# EAGLE design baseband_generator (EAGLE 9.6.2)

## Sheet 1 of 2
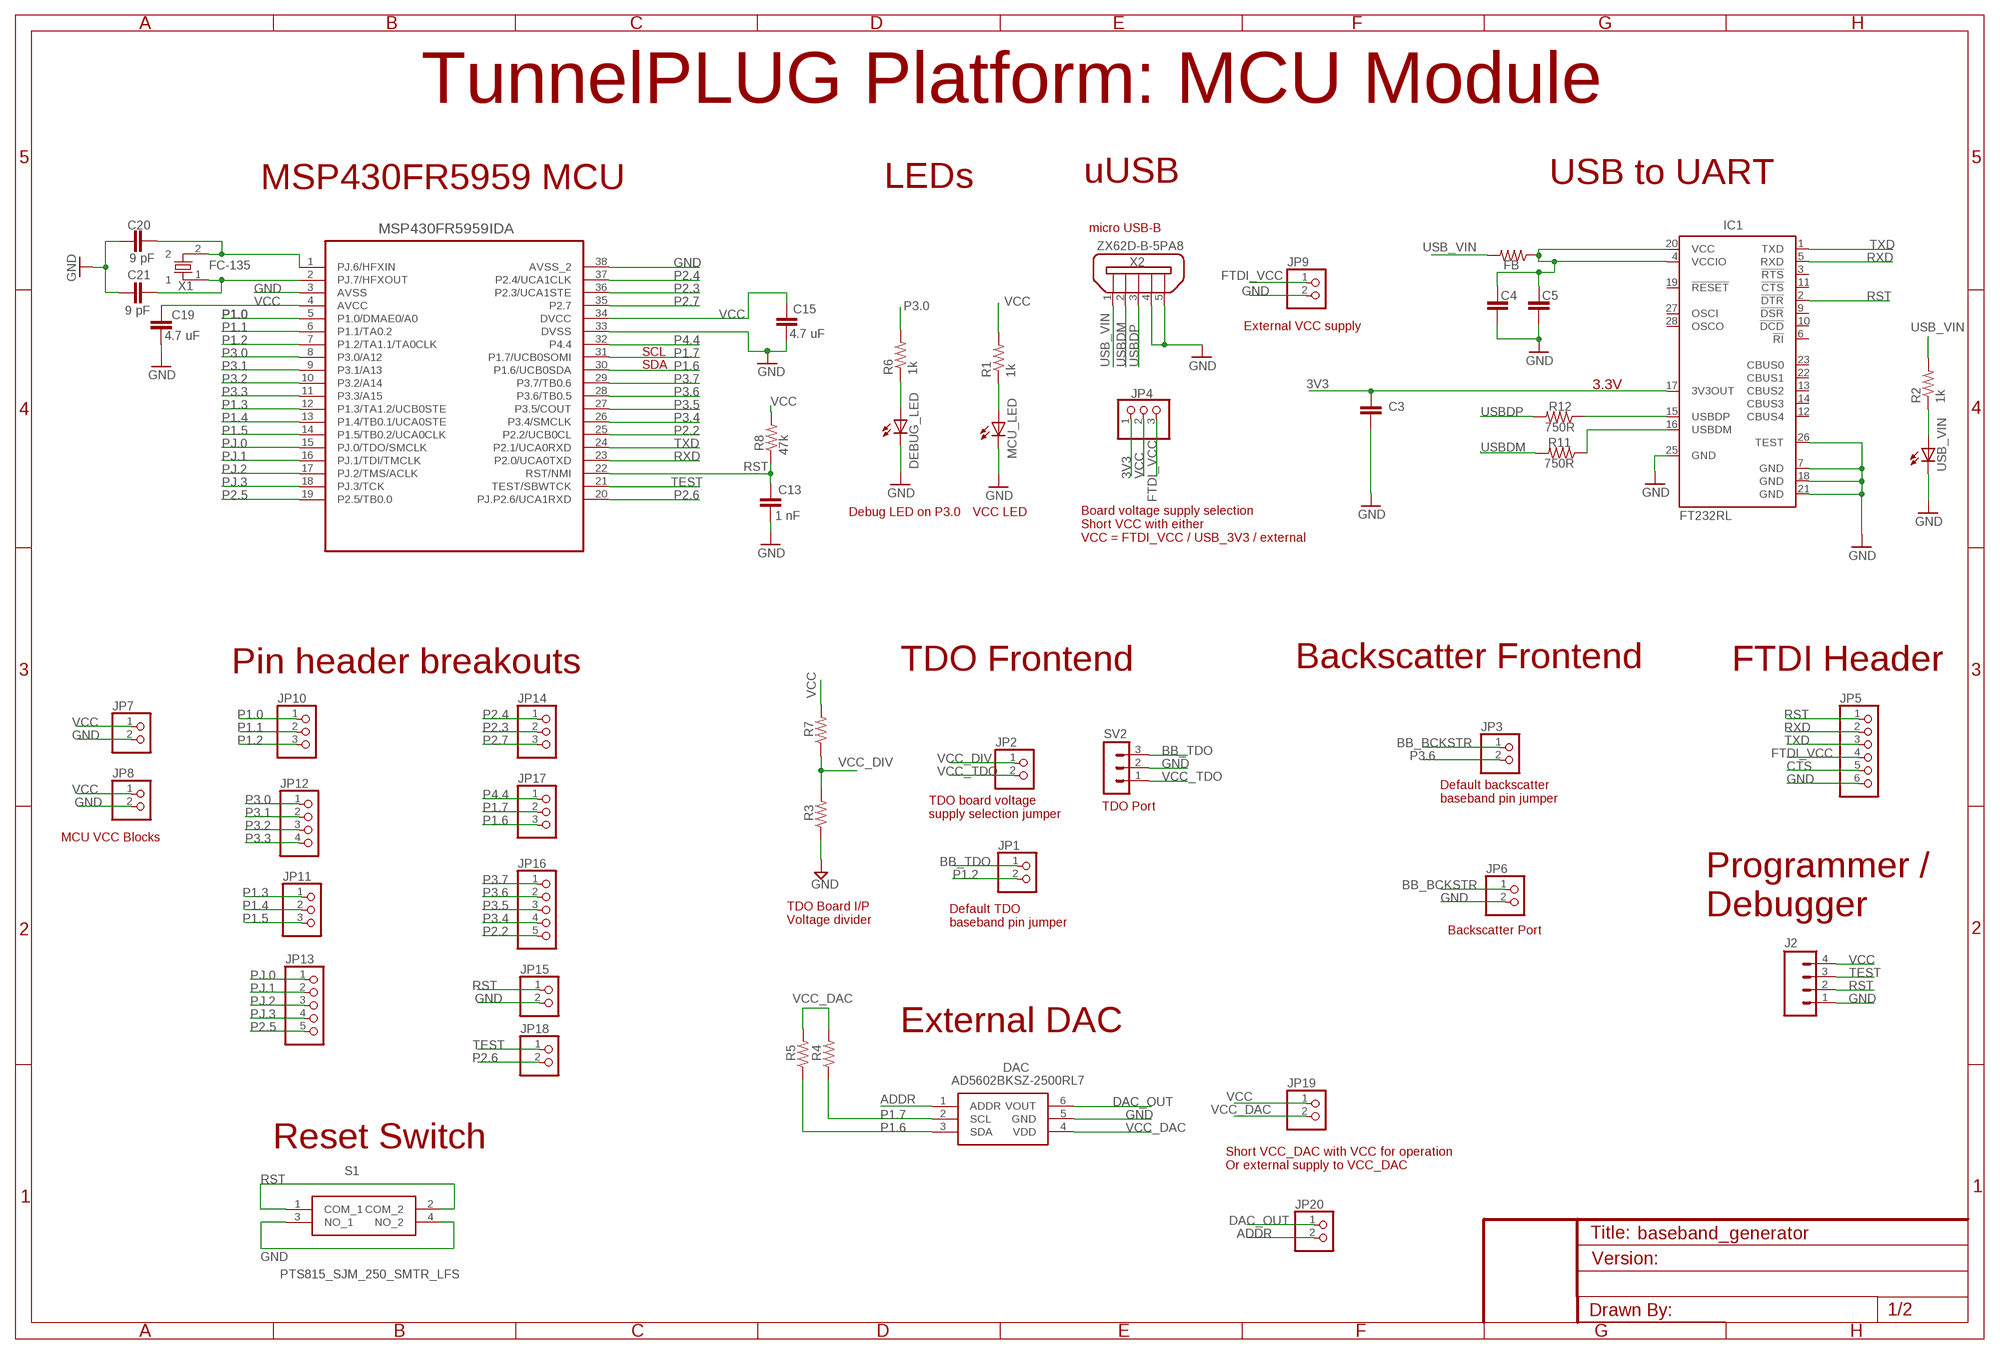
[diagram p0: schematic, sheet 1]

### Parts
C3  0805_1  [0805_1PRIMARY]
C4  0805_1  [0805_1PRIMARY]
C5  0805_1  [0805_1PRIMARY]
C13  1 nF  CAPACITOR  [C0603]
C15  4.7 uF  CAPACITOR  [C0603]
C19  4.7 uF  CAPACITOR  [C0603]
C20  9 pF  CAPACITOR  [C0603]
C21  9 pF  CAPACITOR  [C0603]
DAC  AD5602BKSZ-2500RL7  [SOT65P210X110-6N]
DEBUG_LED  LED0603  [LED-0603]
FB  RESISTOR0805-RES  [0805]
IC1  FT232RL  [SSOP28]
J2  MHDR1X4_1  [MHDR1X4_1PRIMARY]
JP1  PINHD-1X2/LOCK  [1X02/LOCK]
JP2  PINHD-1X2/LOCK  [1X02/LOCK]
JP3  PINHD-1X2/LOCK  [1X02/LOCK]
JP4  PINHD-1X3/LOCK  [1X03/LOCK]
JP5  PINHD-1X6/90  [1X06/90]
JP6  PINHD-1X2  [1X02]
JP7  PINHD-1X2  [1X02]
JP8  PINHD-1X2  [1X02]
JP9  PINHD-1X2  [1X02]
JP10  PINHD-1X3  [1X03]
JP11  PINHD-1X3  [1X03]
JP12  PINHD-1X4  [1X04]
JP13  PINHD-1X5  [1X05]
JP14  PINHD-1X3  [1X03]
JP15  PINHD-1X2  [1X02]
JP16  PINHD-1X5  [1X05]
JP17  PINHD-1X3  [1X03]
JP18  PINHD-1X2  [1X02]
JP19  PINHD-1X2  [1X02]
JP20  PINHD-1X2  [1X02]
MCU_LED  LED0603  [LED-0603]
R1  1k  RESISTOR0805-RES  [0805]
R2  1k  RESISTOR0805-RES  [0805]
R3  R-US_R0603  [R0603]
R4  R-US_R0603  [R0603]
R5  R-US_R0603  [R0603]
R6  1k  RESISTOR0805-RES  [0805]
R7  R-US_R0603  [R0603]
R8  47k  RESISTOR0805-RES  [0805]
R11  750R  RESISTOR0805-RES  [0805]
R12  750R  RESISTOR0805-RES  [0805]
S1  PTS815_SJM_250_SMTR_LFS  [PTS815SJM250SMTRLFS]
SV2  MA03-1  [MA03-1]
U2  MSP430FR5739IDAMSP430FR5959IDA  [SOP65P810X120-38N]
USB_VIN  LED0603  [LED-0603]
X1  FC-135  [FC-135_1PRIMARY]
X2  ZX62D-B-5PA8  [ZX62D-B-5PA8]

### Nets
3V3: C3.1 IC1.17(3V3OUT) JP4.1
ADDR: DAC.1(ADDR) JP20.2
BB_BCKSTR: JP3.1 JP6.1
BB_TDO: JP1.1 SV2.3
CTS: JP5.5
DAC_OUT: DAC.6(VOUT) JP20.1
FTDI_VCC: JP4.3 JP5.4 JP9.1
GND: C3.2 C4.2 C5.2 C13.2 C15.1 C19.2 C20.2 C21.2 DAC.5(GND) DEBUG_LED.C IC1.7(GND) IC1.18(GND) IC1.21(GND) IC1.25(GND) IC1.26(TEST) J2.1 JP5.6 JP6.2 JP7.2 JP8.2 JP9.2 JP15.2 MCU_LED.C R3.1 S1.3(NO_1) S1.4(NO_2) SV2.2 U2.3(AVSS) U2.33(DVSS) U2.38(AVSS_2) USB_VIN.C X2.4 X2.5
N$2: C21.1 U2.2(PJ.7/HFXOUT) X1.1
N$3: C20.1 U2.1(PJ.6/HFXIN) X1.2
N$4: DEBUG_LED.A R6.1
N$5: MCU_LED.A R1.1
N$6: R2.1 USB_VIN.A
N$9: C4.1 C5.1 FB.1 IC1.4(VCCIO) IC1.20(VCC)
N$10: IC1.15(USBDP) R12.1
N$11: IC1.16(USBDM) R11.1
P1.0: JP10.1 U2.5(P1.0/DMAE0/A0)
P1.1: JP10.2 U2.6(P1.1/TA0.2)
P1.2: JP1.2 JP10.3 U2.7(P1.2/TA1.1/TA0CLK)
P1.3: JP11.1 U2.12(P1.3/TA1.2/UCB0STE)
P1.4: JP11.2 U2.13(P1.4/TB0.1/UCA0STE)
P1.5: JP11.3 U2.14(P1.5/TB0.2/UCA0CLK)
P1.6: DAC.3(SDA) JP17.3 R5.1 U2.30(P1.6/UCB0SDA)
P1.7: DAC.2(SCL) JP17.2 R4.1 U2.31(P1.7/UCB0SOMI)
P2.2: JP16.5 U2.25(P2.2/UCB0CL)
P2.3: JP14.2 U2.36(P2.3/UCA1STE)
P2.4: JP14.1 U2.37(P2.4/UCA1CLK)
P2.5: JP13.5 U2.19(P2.5/TB0.0)
P2.6: JP18.2 U2.20(PJ.P2.6/UCA1RXD)
P2.7: JP14.3 U2.35(P2.7)
P3.0: JP12.1 R6.2 U2.8(P3.0/A12)
P3.1: JP12.2 U2.9(P3.1/A13)
P3.2: JP12.3 U2.10(P3.2/A14)
P3.3: JP12.4 U2.11(P3.3/A15)
P3.4: JP16.4 U2.26(P3.4/SMCLK)
P3.5: JP16.3 U2.27(P3.5/COUT)
P3.6: JP3.2 JP16.2 U2.28(P3.6/TB0.5)
P3.7: JP16.1 U2.29(P3.7/TB0.6)
P4.4: JP17.1 U2.32(P4.4)
PJ.0: JP13.1 U2.15(PJ.0/TDO/SMCLK)
PJ.1: JP13.2 U2.16(PJ.1/TDI/TMCLK)
PJ.2: JP13.3 U2.17(PJ.2/TMS/ACLK)
PJ.3: JP13.4 U2.18(PJ.3/TCK)
RST: C13.1 IC1.2(!DTR) J2.2 JP5.1 JP15.1 R8.1 S1.1(COM_1) S1.2(COM_2) U2.22(RST/NMI)
RXD: IC1.5(RXD) JP5.2 U2.23(P2.0/UCA0TXD)
TEST: J2.3 JP18.1 U2.21(TEST/SBWTCK)
TXD: IC1.1(TXD) JP5.3 U2.24(P2.1/UCA0RXD)
USB_VIN: FB.2 R2.2 X2.1
USBDM: R11.2 X2.2
USBDP: R12.2 X2.3
VCC: C15.2 C19.1 J2.4 JP4.2 JP7.1 JP8.1 JP19.1 R1.2 R7.2 R8.2 U2.4(AVCC) U2.34(DVCC)
VCC_DAC: DAC.4(VDD) JP19.2 R4.2 R5.2
VCC_DIV: JP2.1 R3.2 R7.1
VCC_TDO: JP2.2 SV2.1
Unconnected: IC1.3(!RTS) IC1.6(!RI) IC1.9(!DSR) IC1.10(!DCD) IC1.11(!CTS) IC1.12(CBUS4) IC1.13(CBUS2) IC1.14(CBUS3) IC1.19(!RESET) IC1.22(CBUS1) IC1.23(CBUS0) IC1.27(OSCI) IC1.28(OSCO) X2.S1 X2.S2 X2.S3 X2.S4

### Notes on the sheet
- TunnelPLUG Platform: MCU Module
- MSP430FR5959 MCU | LEDs | uUSB | USB to UART
- micro USB-B
- External VCC supply
- SCL
- SDA
- 3.3V
- Debug LED on P3.0 | VCC LED
- Board voltage supply selection
  Short VCC with either
  VCC = FTDI_VCC / USB_3V3 / external
- Pin header breakouts | TDO Frontend | Backscatter Frontend | FTDI Header
- Default backscatter 
  baseband pin jumper
- TDO Port
- TDO board voltage 
  supply selection jumper
- MCU VCC Blocks
- Programmer / 
  Debugger
- TDO Board I/P
  Voltage divider
- Default TDO
  baseband pin jumper
- Backscatter Port
- External DAC
- Reset Switch
- Short VCC_DAC with VCC for operation
  Or external supply to VCC_DAC

## Sheet 2 of 2

## Library data of the parts
C3-C5 = Moo1.2:0805_1
C13 C15 C19-C21 = Moo1.2:CAPACITOR
DAC = AD5602BKSZ_DAC:AD5602BKSZ-2500RL7: ANALOG DEVICES - AD5602BKSZ-2500RL7 - Digital to Analogue Converter, 8 bit, I2C, 2.7V to 5.5V, SC-70, 6 Pins Source: Datasheet <https://www.analog.com/media/en/technical-documentation/data-sheets/ad5602_5612_5622.pdf>; DESCRIPTION: ANALOG DEVICES - AD5602BKSZ-2500RL7 - Digital to Analogue Converter, 8 bit, I2C, 2.7V to 5.5V, SC-70, 6 Pins; HEIGHT: 1.1mm; MANUFACTURER_NAME: Analog Devices; MANUFACTURER_PART_NUMBER: AD5602BKSZ-2500RL7; MOUSER_PART_NUMBER: 584-AD5602BKSZ2500R7; MOUSER_PRICE-STOCK: https://www.mouser.co.uk/ProductDetail/Analog-Devices/AD5602BKSZ-2500RL7?qs=NmRFExCfTkEfdQDybOVnmw%3D%3D
DEBUG_LED MCU_LED USB_VIN = SparkFun-LED:LED: LEDs Standard schematic elements and footprints for 5mm, 3mm, 1206, and 0603 sized LEDs. 5mm - Spark Fun Electronics SKU : COM-00529 (and others)
FB R1 R2 R6 R8 R11 R12 = SparkFun-Resistors:RESISTOR: Resistor Basic schematic elements and footprints for 0603, 1206, and PTH resistors.
IC1 = ftdichip:FT232R: Source: http://www.ftdichip.com/Documents/DataSheets/DS_FT232R_v104.pdf; MPN: FT232RL; OC_FARNELL: 1146032; OC_NEWARK: 91K9918
J2 = Moo1.2:MHDR1X4_1
JP1-JP3 = pin_header:PINHD-1X2: PIN HEADER
JP4 = pin_header:PINHD-1X3: PIN HEADER
JP5 = pinhead:PINHD-1X6: PIN HEADER
JP6-JP9 JP15 JP18-JP20 = pinhead:PINHD-1X2: PIN HEADER
JP10 JP11 JP14 JP17 = pinhead:PINHD-1X3: PIN HEADER
JP12 = pinhead:PINHD-1X4: PIN HEADER
JP13 JP16 = pinhead:PINHD-1X5: PIN HEADER
R3-R5 R7 = rcl:R-US_: RESISTOR, American symbol; SPICEPREFIX: R
S1 = push_button_SW_smd:PTS815_SJM_250_SMTR_LFS: Tactile Switches Tact Switch, 12 VDC, 50 mA, 4.2x3.2, 2.5mm H, 180gf, J leads Source: Datasheet <https://componentsearchengine.com/Datasheets/1/PTS815 SJM 250 SMTR LFS.pdf>; DESCRIPTION: Tactile Switches Tact Switch, 12 VDC, 50 mA, 4.2x3.2, 2.5mm H, 180gf, J leads; HEIGHT: 2.7mm; MANUFACTURER_NAME: C & K COMPONENTS; MANUFACTURER_PART_NUMBER: PTS815 SJM 250 SMTR LFS; MOUSER_PART_NUMBER: 611-PTS815SJM250SMTR; MOUSER_PRICE-STOCK: https://www.mouser.co.uk/ProductDetail/CK/PTS815-SJM-250-SMTR-LFS?qs=ahcBuItHZ3xKWmfV%2F2E6bA%3D%3D
SV2 = con-lstb:MA03-1: PIN HEADER; OC_FARNELL: unknown; OC_NEWARK: unknown
U2 = ambuj:MSP430FR5739IDA: Mixed Signal Microcontroller,TSSOP-38
X1 = Moo1.2:FC-135
X2 = zx62d-b-5pa8-oshpark_10:ZX62D-B-5PA8: Micro USB Type B Connector - Standard, Shell Through Hole Source: http://www.hirose.co.jp/cataloge_hp/ed_ZX_20140804.pdf; MF: Hirose; MPN: ZX62D-B-5PA8; OC_FARNELL: 2300438; OC_NEWARK: 69W0712

## Board
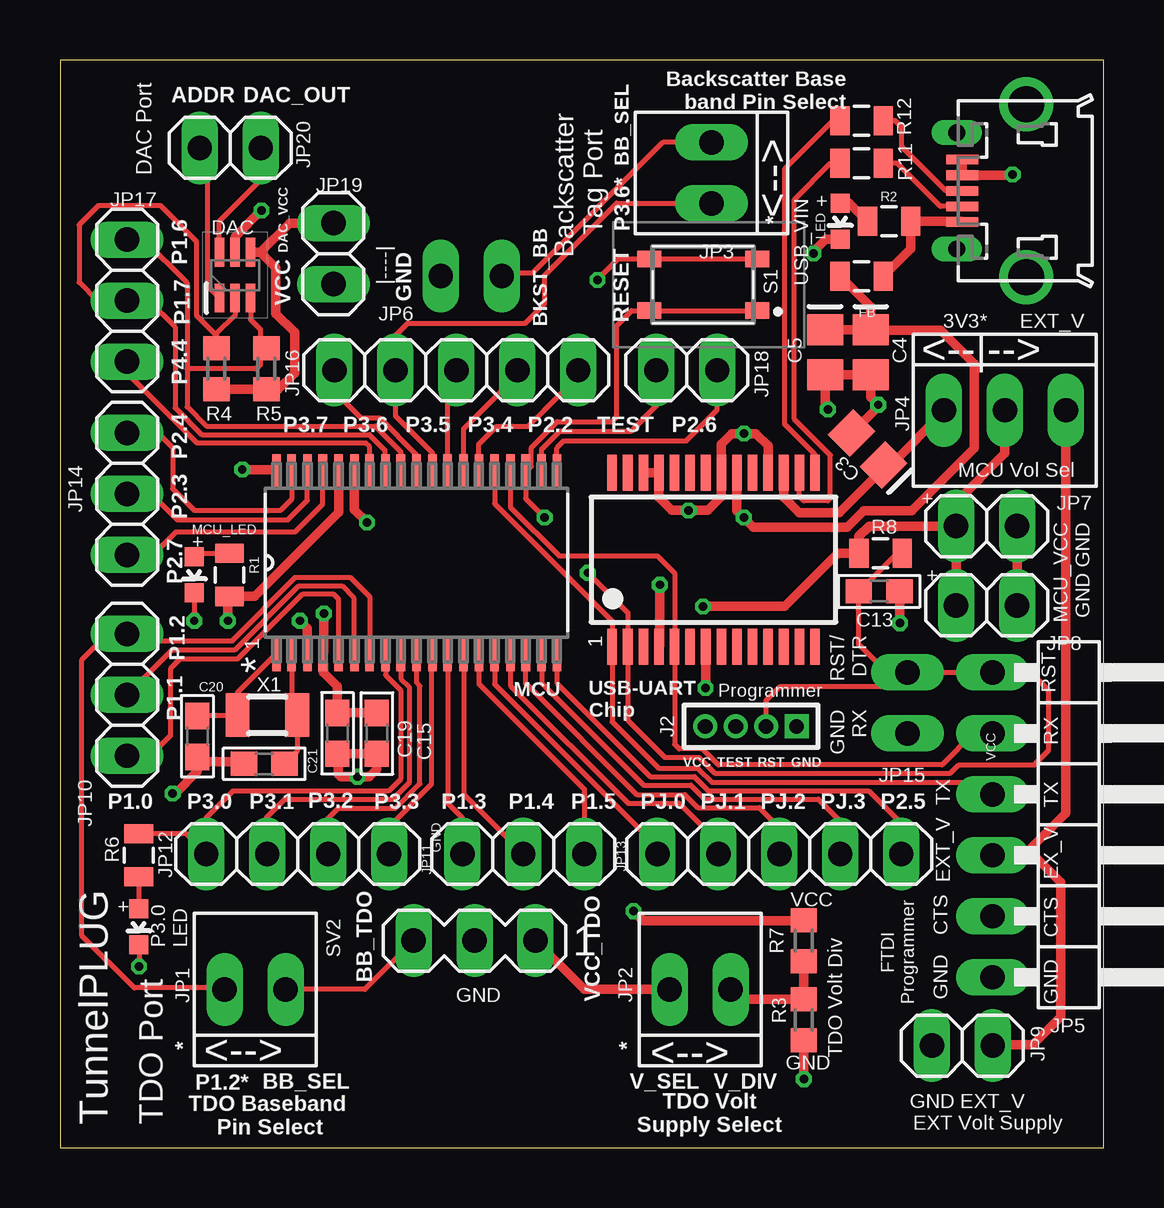
[diagram p1: board, top side]
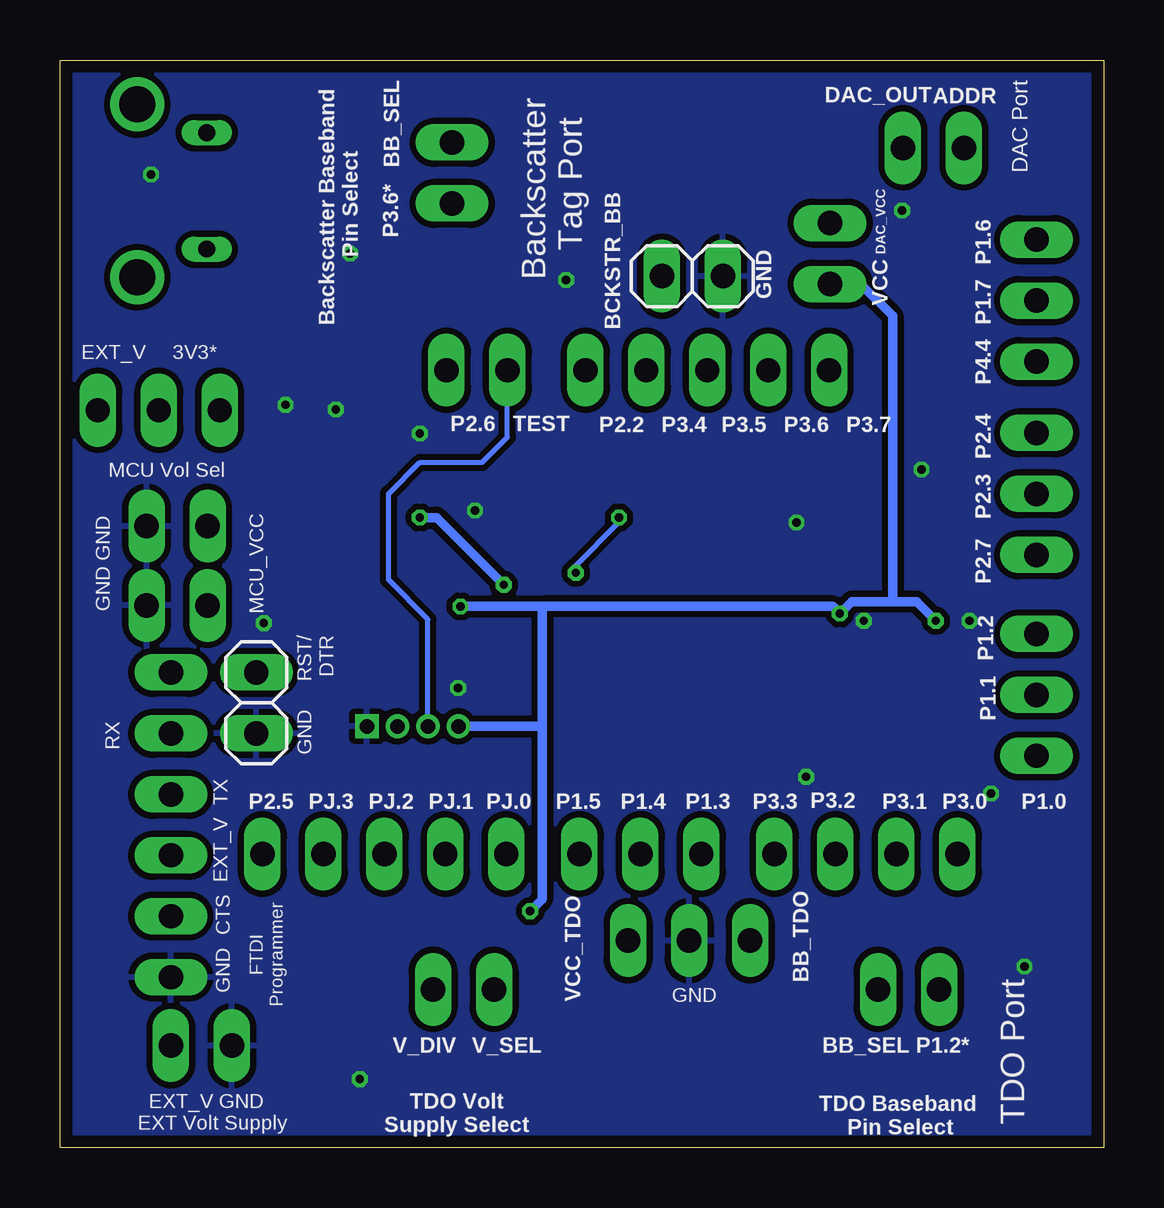
[diagram p2: board, bottom side, seen from below]

Size 43.48 x 45.33 mm. Coordinates in mm from the lower left corner, seen from the top.
Outline: 0,0 43.48,0 43.48,45.33 0,45.33 0,0
Copper layers (1*16): Top 0.035mm / dielectric 1.6mm / Bottom 0.035mm
Design rules "Elecrow_2-layer_PCB_eagle_rule": minimum track width 6mil, minimum drill 12mil, track to track 6mil, track to pad 6mil, pad to pad 6mil, via to via 8mil, smd to smd 0mil, copper to edge 20mil, drill to drill 10mil, minimum pad ring 6mil, minimum via ring 6mil, stop-mask expansion 0mil, vias tented up to drill 100mil, thermal gap 10mil

### Footprints (pad centres in the part's own frame; a part is rotated, then mirrored left to right if it is on the bottom)
0805_1PRIMARY = smd 1.295 x 1.499: 1 -0.94,0; 2 0.94,0
C0603 = smd 1.1 x 1: 1 -0.85,0; 2 0.85,0
SOT65P210X110-6N = smd 1.2 x 0.4: 1 -0.95,0.65; 2 -0.95,0; 3 -0.95,-0.65; 4 0.95,-0.65; 5 0.95,0; 6 0.95,0.65
LED-0603 = smd 0.8 x 0.8: A 0,-0.75; C 0,0.75
0805 = smd 0.8 x 1.2: 1 -0.9,0; 2 0.9,0
SSOP28 = smd 0.4 x 1.5: 1 -4.225,-3.625; 2 -3.575,-3.625; 3 -2.925,-3.625; 4 -2.275,-3.625; 5 -1.625,-3.625; 6 -0.975,-3.625; 7 -0.325,-3.625; 8 0.325,-3.625; 9 0.975,-3.625; 10 1.625,-3.625; 11 2.275,-3.625; 12 2.925,-3.625; 13 3.575,-3.625; 14 4.225,-3.625; 15 4.225,3.625; 16 3.575,3.625; 17 2.925,3.625; 18 2.275,3.625; 19 1.625,3.625; 20 0.975,3.625; 21 0.325,3.625; 22 -0.325,3.625; 23 -0.975,3.625; 24 -1.625,3.625; 25 -2.275,3.625; 26 -2.925,3.625; 27 -3.575,3.625; 28 -4.225,3.625
MHDR1X4_1PRIMARY = drill 0.61 pad 0.991 square: 1 0,0 | drill 0.61 pad 0.991: 2 1.27,0; 3 2.54,0; 4 3.81,0
1X02/LOCK = drill 1.016 long: 1 -1.27,0; 2 1.27,0
1X03/LOCK = drill 1.016 long: 1 -2.54,0; 2 0,0; 3 2.54,0
1X06/90 = drill 1.016 long: 1 -6.35,-3.81; 2 -3.81,-3.81; 3 -1.27,-3.81; 4 1.27,-3.81; 5 3.81,-3.81; 6 6.35,-3.81
1X02 = drill 1.016 long: 1 -1.27,0; 2 1.27,0
1X03 = drill 1.016 long: 1 -2.54,0; 2 0,0; 3 2.54,0
1X04 = drill 1.016 long: 1 -3.81,0; 2 -1.27,0; 3 1.27,0; 4 3.81,0
1X05 = drill 1.016 long: 1 -5.08,0; 2 -2.54,0; 3 0,0; 4 2.54,0; 5 5.08,0
R0603 = smd 1 x 1.1: 1 -0.85,0; 2 0.85,0
PTS815SJM250SMTRLFS = smd 1 x 0.7: 1 -2.25,1.075; 2 2.25,1.075; 3 -2.25,-1.075; 4 2.25,-1.075
MA03-1 = drill 1.016 long: 1 -2.54,0; 2 0,0; 3 2.54,0
SOP65P810X120-38N = smd 1.473 x 0.356: 1 -3.785,5.842; 2 -3.785,5.207; 3 -3.785,4.547; 4 -3.785,3.912; 5 -3.785,3.251; 6 -3.785,2.591; 7 -3.785,1.956; 8 -3.785,1.295; 9 -3.785,0.66; 10 -3.785,0; 11 -3.785,-0.66; 12 -3.785,-1.295; 13 -3.785,-1.956; 14 -3.785,-2.591; 15 -3.785,-3.251; 16 -3.785,-3.912; 17 -3.785,-4.547; 18 -3.785,-5.207; 19 -3.785,-5.842; 20 3.785,-5.842; 21 3.785,-5.207; 22 3.785,-4.547; 23 3.785,-3.912; 24 3.785,-3.251; 25 3.785,-2.591; 26 3.785,-1.956; 27 3.785,-1.295; 28 3.785,-0.66; 29 3.785,0; 30 3.785,0.66; 31 3.785,1.295; 32 3.785,1.956; 33 3.785,2.591; 34 3.785,3.251; 35 3.785,3.912; 36 3.785,4.547; 37 3.785,5.207; 38 3.785,5.842
FC-135_1PRIMARY = smd 0.991 x 1.803: 1 -1.245,0; 2 1.245,0
ZX62D-B-5PA8 = smd 1.35 x 0.4: 1 4.825,1.3; 2 4.825,0.65; 3 4.825,0; 4 4.825,-0.65; 5 4.825,-1.3 | drill 1.5: S1 2.15,-3.6; S2 2.15,3.6 | drill 0.7 long: S3 5.05,2.425; S4 5.05,-2.425

### Placement (x,y rotation side)
C3  33.65,29.12 135 top
C4  33.78,33.15 270 top
C5  31.88,33.15 270 top
C13  34.13,23.2 0 top
C15  13.21,17.27 90 top
C19  11.56,17.27 270 top
C20  5.71,17.14 270 top
C21  8.51,16 180 top
DAC  7.29,36.36 90 top
DEBUG_LED  3.28,9.22 180 top
FB  33.4,36.32 0 top
IC1  27.23,24.51 0 top
J2  30.69,17.56 180 top
JP1  8.13,6.6 180 top
JP2  26.67,6.6 180 top
JP3  27.15,40.62 270 top
JP4  39.37,30.73 0 top
JP5  42.67,13.46 270 top
JP6  17.13,36.32 0 bottom
JP7  38.61,25.91 0 top
JP8  38.61,22.61 0 top
JP9  37.6,4.26 180 top
JP10  2.79,18.88 90 top
JP11  19.3,12.25 0 top
JP12  9.91,12.25 0 top
JP13  29.97,12.25 0 top
JP14  2.79,27.25 270 top
JP15  35.31,18.54 270 bottom
JP16  16.52,32.4 0 top
JP17  2.79,35.31 90 top
JP18  26.11,32.4 0 top
JP19  11.39,37.26 90 top
JP20  7.09,41.66 180 top
MCU_LED  5.6,23.88 180 top
R1  7.07,23.88 270 top
R2  34.54,38.61 0 top
R3  30.99,5.33 90 top
R4  6.52,32.46 270 top
R5  8.6,32.46 270 top
R6  3.28,12.19 90 top
R7  30.99,8.64 90 top
R8  34.19,24.78 180 top
R11  33.4,41.02 0 top
R12  33.4,42.8 0 top
S1  26.79,35.96 180 top
SV2  17.27,8.64 180 top
U2  14.86,24.38 90 top
USB_VIN  32.51,38.61 180 top
X1  8.64,18.03 180 top
X2  42.42,39.88 180 top

### Tracks (layer width: path | path; a pad name or v marks a point on that pad's centre or on a via)
3V3
  Top 0.4: IC1.17 30.16,27.1 30.79,26.46 32.46,26.46 34.32,28.32 C3.1 34.62,28.45 36.83,30.67 JP4.1
ADDR
  Top 0.2: DAC.1 6.15,35.91 6.15,40.31 5.82,40.63 JP20.2
BB_BCKSTR
  Top 0.2: JP6.1 18.55,36.46 19.7,36.46 25.12,41.89 JP3.1
BB_TDO
  Top 0.2: SV2.3 12.7,6.6 JP1.1
DAC_OUT
  Top 0.2: DAC.6 6.64,38.61 8.36,40.33 JP20.1
FTDI_VCC
  Top 0.4: JP4.3 41.91,13.94 40.16,12.19 JP5.4 40.57,12.19 41.69,11.06 41.69,5.46 40.53,4.29 38.9,4.29 JP9.1
GND  (via drill 0.35)
  Top 0.2: DEBUG_LED.C v3.29,7.56 | MCU_LED.C v5.6,21.97 v5.59,21.96 | S1.3 S1.4 23.27,37.04 v22.39,36.16
  Top 0.4: JP8.2 JP7.2 | IC1.26 IC1.25 24.96,27.1 25.49,26.56 v26.19,26.56 26.99,26.56 27.56,27.13 IC1.21 27.56,29.33 27.99,29.76 v28.49,29.76 28.99,29.76 29.51,29.25 IC1.18 | X2.5 X2.4 39.66,40.53 v39.69,40.56 | C19.2 11.59,16.42 | 11.59,16.42 C15.1 13.21,15.78 12.89,15.46 v12.39,15.46 11.69,15.46 11.59,15.56 11.59,16.42 | C21.2 7.57,16.09 5.92,16.09 C20.2 5.71,15.69 4.79,14.76 v4.69,14.76 | R3.1 v30.99,2.86 | v12.79,26.06 12.27,26.59 U2.33 | U2.38 8.92,28.26 v7.59,28.26 | IC1.7 26.91,19.18 v26.89,19.16 | v31.99,30.76 31.88,30.88 C5.2 C4.2 33.78,31.28 v34.09,30.96 34.09,30.89 C3.2 | v31.39,37.26 31.39,37.34 31.91,37.86 USB_VIN.C | C13.2 34.98,21.88 v34.99,21.86 | v9.99,21.96 10.31,21.65 U2.3 | DAC.5 7.29,37.96 v8.39,39.06
  pour Bottom (isolate 0.254): 0,45.34 43.43,45.34 43.43,0 0,0
N$2
  Top 0.2: U2.2 9.65,18.26 X1.1 9.88,16.52 C21.1
N$3
  Top 0.2: U2.1 7.39,18.97 X1.2 5.75,18.03 C20.1
N$4
  Top 0.2: R6.1 DEBUG_LED.A
N$5
  Top 0.2: MCU_LED.A 5.75,24.78 R1.1
N$6
  Top 0.4: USB_VIN.A 32.89,39.36 R2.1
N$9  (via drill 0.35)
  Top 0.4: FB.1 33.78,35.04 C4.1 | C4.1 C5.1 | C4.1 33.8,34.06 36.69,34.06 38.09,32.66 38.09,29.16 35.49,26.56 33.49,26.56 32.79,25.86 28.89,25.86 v28.49,26.26 28.21,26.55 IC1.20 | IC1.4 24.99,20.92 v24.99,23.46
  Bottom 0.4: v28.49,26.26 27.79,26.26 v24.99,23.46
N$10
  Top 0.2: R12.1 32.2,42.8 30.19,40.79 30.19,30.16 31.46,28.89 IC1.15
N$11
  Top 0.2: R11.1 32.1,41.02 30.59,39.51 30.59,30.36 32.09,28.86 32.09,27.06 31.99,26.96 30.99,26.96 30.81,27.15 IC1.16
P1.0
  Top 0.2: JP10.1 3.77,16.34 4.59,17.16 4.59,19.96 4.99,20.36 7.39,20.36 10.09,23.06 11.41,23.06 11.61,22.86 U2.5
P1.1
  Top 0.2: JP10.2 4.68,20.76 7.3,20.76 9.95,23.42 11.75,23.42 12.24,22.93 12.24,20.63 U2.6
P1.2
  Top 0.2: U2.7 12.9,22.97 12.1,23.77 9.8,23.77 7.15,21.12 3.09,21.12 JP10.3 1.99,21.42 0.89,20.32 0.89,8.86 3.09,6.66 6.8,6.66 JP1.2
P1.3
  Top 0.2: U2.12 16.15,14.36 16.76,13.75 JP11.1
P1.4
  Top 0.2: U2.13 16.82,14.73 JP11.2
P1.5
  Top 0.2: U2.14 17.45,19.34 21.84,14.95 JP11.3
P1.6
  Top 0.2: U2.30 14.19,29.01 13.14,30.07 6.1,30.07 5.29,30.88 5.29,32.46 | JP17.3 3.49,37.85 5.29,36.05 5.29,32.46 | DAC.3 7.94,34.51 8.34,34.11 8.34,33.57 R5.1 8.35,33.06 8.35,32.63 8.18,32.46 5.29,32.46
P1.7
  Top 0.2: U2.31 13.53,28.2 13.53,29.07 12.89,29.72 5.91,29.72 4.79,30.83 4.79,34.21 3.69,35.31 JP17.2 1.55,35.31 0.79,36.06 0.79,38.46 1.59,39.26 4.19,39.26 5.69,37.76 5.69,34.68 6.46,33.91 6.46,33.36 R4.1 6.52,33.91 7.29,34.69 DAC.2
P2.2
  Top 0.2: U2.25 17.45,29.32 18.19,30.06 19.49,30.06 20.19,30.76 20.3,30.87 21.6,32.17 JP16.5
P2.3
  Top 0.2: JP14.2 3.81,27.25 4.89,26.16 9.49,26.16 10.31,26.98 U2.36
P2.4
  Top 0.2: U2.37 9.65,27.02 9.19,26.56 5.59,26.56 4.69,27.46 4.69,29.16 4.07,29.79 JP14.1
P2.5
  Top 0.2: JP13.5 35.05,13.52 33.69,14.88 27.02,14.88 26.43,15.47 24.59,15.47 20.7,19.36 U2.19
P2.6
  Top 0.2: U2.20 20.7,29.17 21,29.46 26.09,29.46 27.38,30.75 JP18.2
P2.7
  Top 0.2: JP14.3 3.89,24.71 4.85,25.66 9.79,25.66 10.95,26.82 U2.35
P3.0
  Top 0.2: U2.8 13.56,19.69 14.19,19.06 14.19,15.36 13.69,14.86 7.19,14.86 6.09,13.76 JP12.1 5.25,13.09 R6.2
P3.1
  Top 0.2: U2.9 14.2,19.56 14.55,19.21 14.55,15.22 13.84,14.51 9.34,14.51 8.59,13.76 8.59,12.29 JP12.2
P3.2
  Top 0.2: U2.10 14.86,19.4 15,19.26 15,15.17 13.99,14.16 11.59,14.16 11.18,13.74 JP12.3
P3.3
  Top 0.2: U2.11 15.49,20.57 15.49,15.16 13.72,13.39 JP12.4
P3.4
  Top 0.2: U2.26 16.82,29.96 19.06,32.2 JP16.4
P3.5
  Top 0.2: U2.27 16.15,28.26 16.15,32.04 JP16.3
P3.6
  Top 0.2: U2.28 15.52,28.96 13.98,30.5 JP16.2 13.98,33.85 14.49,34.36 19.39,34.36 20.19,35.16 20.19,36.36 23.19,39.36 27.14,39.36 JP3.2
P3.7
  Top 0.2: U2.29 14.83,28.2 14.83,28.91 13.32,30.42 12.54,30.42 11.44,31.52 JP16.1
P4.4
  Top 0.2: U2.32 12.9,29.21 12.74,29.36 5.71,29.36 2.79,32.28 JP17.1
PJ.0
  Top 0.2: U2.15 18.11,19.33 24.89,12.55 JP13.1
PJ.1
  Top 0.2: U2.16 18.77,19.27 23.67,14.36 25.79,14.36 27.43,12.73 JP13.2
PJ.2
  Top 0.2: JP13.3 29.97,13.35 29.14,14.18 26.58,14.18 26.04,14.72 24.04,14.72 19.41,19.35 U2.17
PJ.3
  Top 0.2: U2.18 20.07,19.36 24.31,15.12 26.29,15.12 26.88,14.53 31.59,14.53 32.51,13.61 JP13.4
RST  (via drill 0.35)
  Top 0.2: JP15.1 34.45,19.81 33.28,20.98 C13.1 33.28,23.17 34.79,24.68 34.99,24.68 R8.1 | JP15.1 JP5.1 40.45,19.81 41.19,19.06 41.19,16.56 40.59,15.96 37.45,15.96 37.1,15.61 27.29,15.61 26.62,16.27 25.19,16.27 23.66,17.81 IC1.2 23.66,22.3 v21.99,23.96 | v20.19,26.26 19.41,27.05 U2.22 19.64,28.4 19.64,29.17 20.73,30.26 22.99,30.26 23.19,30.46 23.19,34.26 23.82,34.89 S1.2 S1.1 | J2.2 29.42,18.64 29.99,19.21 34.71,19.21 JP15.1
  Bottom 0.2: v20.19,26.26 20.19,26.06 21.99,24.26 v21.99,23.96
RXD
  Top 0.2: JP5.2 38.06,17.27 36.75,15.96 27.43,15.96 26.77,16.63 25.79,16.63 25.61,16.81 IC1.5 25.61,23.95 24.89,24.66 20.79,24.66 18.77,26.69 U2.23
TEST
  Top 0.2: U2.21 20.07,29.11 20.82,29.86 23.79,29.86 24.84,30.91 JP18.1
  Bottom 0.2: J2.3 28.15,22.02 29.79,23.66 29.79,27.26 28.49,28.56 25.89,28.56 24.84,29.61 JP18.1
TXD
  Top 0.2: JP5.3 38.36,15.23 27.17,15.23 26.58,15.82 24.94,15.82 23.01,17.75 IC1.1 23.01,21.95 18.11,26.85 U2.24
USB_VIN
  Top 0.4: X2.1 37.56,38.61 R2.2 35.44,37.47 FB.2
USBDM
  Top 0.2: R11.2 34.89,41.02 36.68,39.23 X2.2
USBDP
  Top 0.2: R12.2 34.8,42.8 35.07,42.53 35.07,41.72 36.91,39.88 X2.3
VCC  (via drill 0.35)
  Top 0.4: JP7.1 37.34,26.9 39.37,28.93 JP4.2 | JP8.1 JP7.1 | JP7.1 33.72,25.91 33.29,25.48 R8.2 32.41,24.78 30.19,22.56 v26.79,22.56 | v10.99,22.26 10.99,20.65 U2.4 10.98,20.57 10.98,19.82 11.56,19.24 C19.1 C15.2 | v6.99,21.96 6.99,22.9 R1.2 8.11,22.98 11.61,26.48 U2.34 | v23.89,9.86 24.29,9.46 30.97,9.46 R7.2
  Bottom 0.4: v26.79,22.56 23.29,22.56 | v6.99,21.96 7.79,22.76 8.79,22.76 | 8.79,22.76 10.49,22.76 v10.99,22.26 11.29,22.56 23.29,22.56 | 23.29,22.56 23.39,22.46 23.39,17.56 | 23.39,17.56 23.39,10.36 v23.89,9.86 | JP19.1 10.12,35.99 8.79,34.66 8.79,22.76 | J2.4 23.39,17.56
VCC_DAC
  Top 0.4: DAC.4 8.34,37.31 | 8.34,37.31 9.56,38.53 JP19.2 | R4.2 R5.2 9.1,31.61 9.77,32.29 9.77,33.98 8.99,34.76 8.99,36.66 8.34,37.31
VCC_DIV
  Top 0.4: R7.1 R3.2 28.36,6.18 JP2.1
VCC_TDO
  Top 0.4: JP2.2 21.84,6.6 SV2.1

### Text on the board
tPlace: VCC | GND
tNames: BB_SEL | Backscatter Base / band Pin Select | ADDR | DAC_OUT | DAC Port | Backscatter / Tag Port | P3.6* | * | <--> | + | BKST_BB | LED | P1.6 | DAC_VCC | GND | |----| | VCC | P1.7 | RESET | 3V3* | EXT_V | <--|--> | P4.4 | P3.7 | P3.6 | P3.5 | P3.4 | P2.2 | TEST | P2.6 | P2.4 | MCU Vol Sel | + | P2.3 | MCU_VCC / GND GND | + | + | P2.7 | 1 | 1 | RST/ / DTR | RST | P1.2 | X1 | MCU | Programmer | P1.1 | USB-UART / Chip | GND / RX | RX | VCC | TEST | RST | GND | P1.0 | P3.0 | P3.1 | P3.3 | P1.3 | P1.4 | P1.5 | PJ.0 | PJ.1 | PJ.2 | PJ.3 | P2.5 | TX | TX | P3.2 | EXT_V | EX_V | + | VCC | CTS | CTS | P3.0 / LED | FTDI / Programmer | GND | GND | BB_TDO | GND | VCC_TDO | * | * | TDO Volt Div | <--> | P1.2* | <--> | GND | BB_SEL | V_SEL | V_DIV | GND EXT_V | TunnelPLUG | TDO Port | TDO Baseband / Pin Select | TDO Volt / Supply Select | EXT Volt Supply
bNames: ADDR | BB_SEL | DAC_OUT | DAC Port | BCKSTR_BB | Backscatter / Tag Port | Backscatter Baseband / Pin Select | P3.6* | P1.6 | DAC_VCC | GND | VCC | P1.7 | 3V3* | EXT_V | P4.4 | P3.7 | P3.6 | P3.5 | P3.4 | P2.2 | TEST | P2.6 | P2.4 | MCU Vol Sel | P2.3 | P2.7 | MCU_VCC | GND GND | RST/ / DTR | P1.2 | P1.1 | GND | RX | P1.0 | P3.0 | P3.1 | P3.3 | P1.3 | P1.4 | P1.5 | PJ.0 | PJ.1 | PJ.2 | PJ.3 | P2.5 | TX | P3.2 | EXT_V | CTS | FTDI / Programmer | BB_TDO | GND | VCC_TDO | GND | P1.2* | BB_SEL | V_SEL | V_DIV | EXT_V GND | TDO Port | TDO Baseband / Pin Select | TDO Volt / Supply Select | EXT Volt Supply